# Altium schematic sheet Ultrasonic_Interface.SchDoc: 5V Ultrasonic Interface
size A4; DrawnBy: Samyar Sadat Akhavi; Revision: 1.0; SheetNumber: 5; SheetTotal: 13
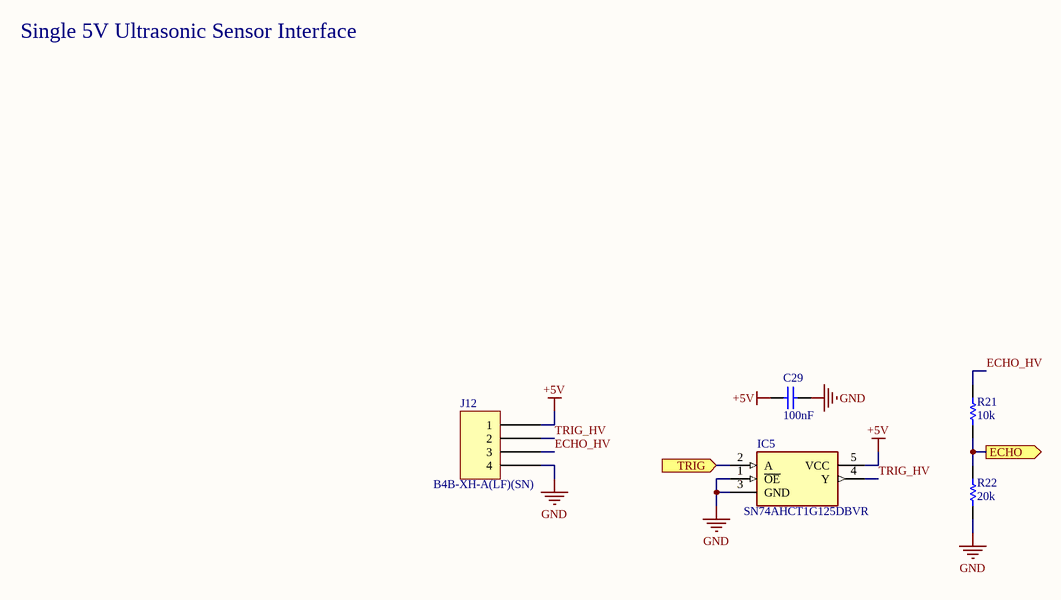
[diagram p0: Ultrasonic_Interface.SchDoc]

## Parts
?  (no value)  (graphical)
C29  100nF  [CAP_SMD_603]
IC5  SN74AHCT1G125DBVR  [SOT95P280X145-5N]
J12  B4B-XH-A(LF)(SN)  [JST XH B4B-XH-A]
R21  10k  [RES_0603]
R22  20k  [RES_0603]

## Ports
ECHO (out, see Sensors_IO[3A]), TRIG (in, see Sensors_IO[3A])

## Nets
+5V: C29.2 IC5.5(VCC) J12.1
GND: C29.1 IC5.1(~{OE}) IC5.3(GND) J12.4 R22.2
ECHO: R21.2 R22.1 ; port ECHO
ECHO_HV: J12.3 R21.1
TRIG: IC5.2(A) ; port TRIG
TRIG_HV: IC5.4(Y) J12.2

## Notes on the sheet
- Single 5V Ultrasonic Sensor Interface
- Sub-Project:
- Size:
- Drawn By:
- Revision:
- Date:
- File:
- Sheet:
- of

## Library data of the parts
? = Standard Title Block
C29 = Non-polar Capacitor: Generic Ceramic Capacitor; Voltage: 6.3V; Value: 100nF
IC5 = SN74AHCT1G125DBVR: Integrated Circuit; Manufacturer_Name: Texas Instruments; Datasheet Link: http://www.ti.com/lit/ds/symlink/sn74ahct1g125.pdf; Height: 1.45mm; Manufacturer_Part_Number: SN74AHCT1G125DBVR; Mouser Part Number: 595-SNAHCT1G125DBVR; Mouser Price/Stock: https://www.mouser.co.uk/ProductDetail/Texas-Instruments/SN74AHCT1G125DBVR?qs=N6WZOzgtpqVaVW8Lh%252BgevA%3D%3D; Arrow Part Number: SN74AHCT1G125DBVR; Arrow Price/Stock: https://www.arrow.com/en/products/sn74ahct1g125dbvr/texas-instruments?utm_currency=USD&region=nac
J12 = B4B-XH-A(LF)(SN): CONN HEADER VERT 4POS 2.5MM; Manufacturer: JST Sales America Inc.; Contact Length - Post: 0.134" (3.40mm); Current Rating (Amps): 3A; Material Flammability Rating: UL94 V-0; Number of Positions: 4; Number of Positions Loaded: All; Pitch - Mating: 0.098" (2.50mm); Shrouding: Shrouded - 4 Wall; Style: Board to Cable/Wire; Voltage Rating: 250V; Part Number: B4B-XH-A(LF)(SN); ComponentLink1Description: Datasheet; ComponentLink1URL: http://www.jst-mfg.com/product/pdf/eng/eXH.pdf; ComponentLink2Description: DigiKey Link; ComponentLink2URL: http://digikey.com/product-detail/en/jst-sales-america-inc/B4B-XH-A-LF-SN/455-2249-ND/1651047; Connector Type: Header; Contact Finish - Mating: Tin; Contact Finish - Post: Tin; Contact Material: Brass; Contact Shape: Square; Contact Type: Male Pin; Fastening Type: Detent Lock; Insulation Color: Natural; Insulation Height: 0.276" (7.00mm); Insulation Material: Polyamide (PA66), Nylon 6/6; LastUpdated: 1/12/2020 11:46:34 PM; Lifecycle Status: Active; Minimum Order: 1; Mounting Type: Through Hole; Number of Rows: 1; Operating Temperature: -25°C ~ 85°C; Packaging: Bulk; PartId: 69; Part Status: Active; Price: 0.21; Series: XH; Supplier 1: DigiKey; Supplier Part Number 1: 455-2249-ND; Termination: Press-Fit, Solder
R21 R22 = Resistor: Power: 1/8W
  R21: Value: 10k
  R22: Value: 20k